# Altium schematic sheet keyboard84.SchDoc
size A3
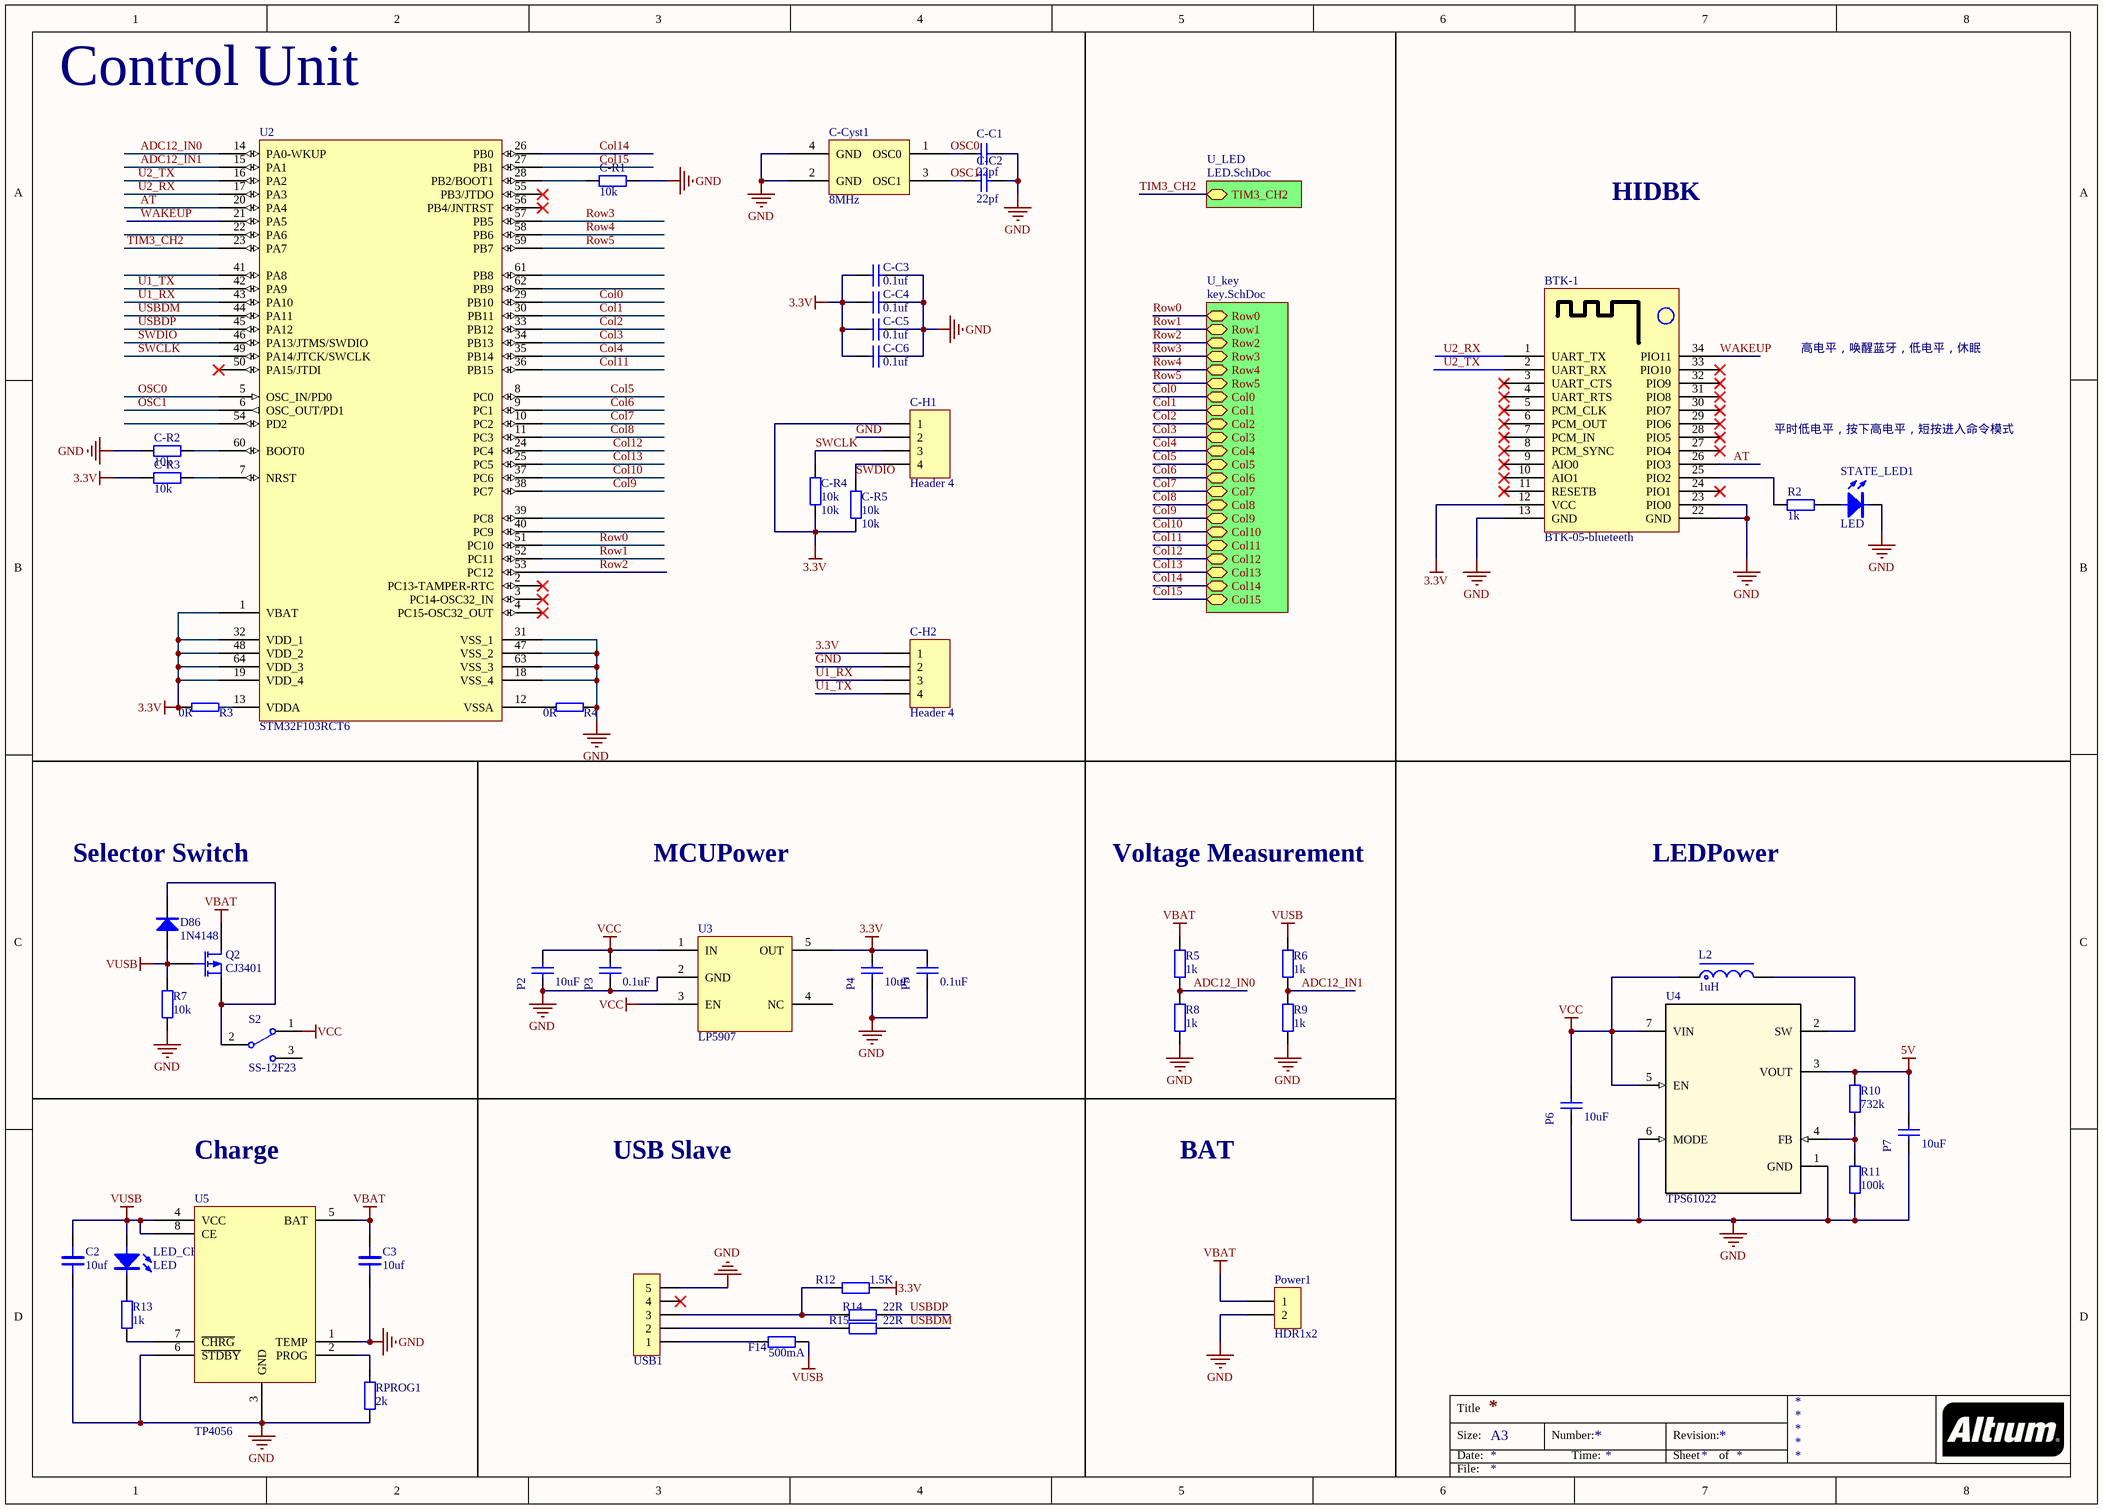
[diagram p0: keyboard84.SchDoc]

## Parts
BTK-1  BTK-05-blueteeth  [BTK-05-bluteeth]
C2  10uf  [C 0603_L]
C3  10uf  [C 0603_L]
C-C1  22pf  [C 0402_L]
C-C2  22pf  [C 0402_L]
C-C3  0.1uf  [C 0402_L]
C-C4  0.1uf  [C 0402_L]
C-C5  0.1uf  [C 0402_L]
C-C6  0.1uf  [C 0402_L]
C-Cyst1  8MHz  [OSC 3225-4P]
C-H1  Header 4  [GH1.25-4P - duplicate]
C-H2  Header 4  [GH1.25-4P - duplicate]
C-R1  10k  [R 0402_L]
C-R2  10k  [R 0402_L]
C-R3  10k  [R 0402_L]
C-R4  10k  [R 0402_L]
C-R5  10k  [R 0402_L]
D86  1N4148  [SOD-323]
F14  500mA  [R 0603_L]
L2  1uH  [CD31]
LED_CHRG1  LED  [LED 0603W]
P2  10uF  [C 0603_L]
P3  0.1uF  [C 0603_L]
P4  10uF  [C 0603_L]
P5  0.1uF  [C 0603_L]
P6  10uF  [C 0603_L]
P7  10uF  [C 0603_L]
Power1  HDR1x2  [HDR2.54-LI-2P]
Q2  CJ3401  [SOT23-3]
R2  1k  [R 0603_L]
R3  0R  [R 0402_L]
R4  0R  [R 0402_L]
R5  1k  [R 0603_L]
R6  1k  [R 0603_L]
R7  10k  [R 0603_L]
R8  1k  [R 0603_L]
R9  1k  [R 0603_L]
R10  732k  [R 0603_L]
R11  100k  [R 0603_L]
R12  1.5K  [R 0402_L]
R13  1k  [R 0603_L]
R14  22R  [R 0402_L]
R15  22R  [R 0402_L]
RPROG1  2k  [R 0603_L]
S2  SS-12F23  [SS-12D10]
STATE_LED1  LED  [LED 0603W]
U2  STM32F103RCT6  [LQFP64_L]
U3  LP5907  [SOT23-5N]
U4  TPS61022  [VQFN-7]
U5  TP4056  [ESOP8_N]
USB1  USB Slave_c  [USB-MICRO - duplicate]  (value not drawn)

## Sub-sheets
U_key = key.SchDoc: Row0 (bidir), Row1 (bidir), Row2 (bidir), Row3 (bidir), Row4 (bidir), Row5 (bidir), Col0 (bidir), Col1 (bidir), Col2 (bidir), Col3 (bidir), Col4 (bidir), Col5 (bidir), Col6 (bidir), Col7 (bidir), Col8 (bidir), Col9 (bidir), Col10 (bidir), Col11 (bidir), Col12 (bidir), Col13 (bidir), Col14 (bidir), Col15 (bidir)
U_LED = LED.SchDoc: TIM3_CH2 (bidir)

## Nets
3.3V: BTK-1.12(VCC) C-C3.2 C-C4.2 C-C5.2 C-C6.2 C-H1.1 C-H2.1 C-R3.1 C-R4.1 C-R5.1 P4.2 P5.2 R3.2 R12.1 U2.1(VBAT) U2.19(VDD_4) U2.32(VDD_1) U2.48(VDD_2) U2.64(VDD_3) U3.5(OUT)
5V: P7.2 R10.2 U4.3(VOUT)
GND: BTK-1.13(GND) BTK-1.22(GND) BTK-1.23(PIO0) C2.1 C3.1 C-C1.1 C-C2.1 C-C3.1 C-C4.1 C-C5.1 C-C6.1 C-Cyst1.2(GND) C-Cyst1.4(GND) C-H1.2 C-H2.2 C-R1.1 C-R2.1 P2.1 P3.1 P4.1 P5.1 P6.1 P7.1 Power1.2 R4.1 R7.1 R8.1 R9.1 R11.1 RPROG1.1 STATE_LED1.2(C) U2.18(VSS_4) U2.31(VSS_1) U2.47(VSS_2) U2.63(VSS_3) U3.2(GND) U4.1(GND) U4.6(MODE) U5.1(TEMP) U5.3(GND) U5.6(~{STDBY}) USB1.5
VBAT: C3.2 Power1.1 Q2.2(D) R5.2 U5.5(BAT)
VCC: L2.1 P2.2 P3.2 P6.2 S2.1 U3.1(IN) U3.3(EN) U4.5(EN) U4.7(VIN)
VUSB: C2.2 D86.1(A) F14.1 LED_CHRG1.1(A) Q2.1(G) R6.2 R7.2 U5.4(VCC) U5.8(CE)
ADC12_IN0: R5.1 R8.2 U2.14(PA0-WKUP)
ADC12_IN1: R6.1 R9.2 U2.15(PA1)
AT: BTK-1.26(PIO3) U2.20(PA4)
Col0: U2.29(PB10) ; sheet U_key/Col0
Col1: U2.30(PB11) ; sheet U_key/Col1
Col2: U2.33(PB12) ; sheet U_key/Col2
Col3: U2.34(PB13) ; sheet U_key/Col3
Col4: U2.35(PB14) ; sheet U_key/Col4
Col5: U2.8(PC0) ; sheet U_key/Col5
Col6: U2.9(PC1) ; sheet U_key/Col6
Col7: U2.10(PC2) ; sheet U_key/Col7
Col8: U2.11(PC3) ; sheet U_key/Col8
Col9: U2.38(PC7) ; sheet U_key/Col9
Col10: U2.37(PC6) ; sheet U_key/Col10
Col11: U2.36(PB15) ; sheet U_key/Col11
Col12: U2.24(PC4) ; sheet U_key/Col12
Col13: U2.25(PC5) ; sheet U_key/Col13
Col14: U2.26(PB0) ; sheet U_key/Col14
Col15: U2.27(PB1) ; sheet U_key/Col15
OSC0: C-C1.2 C-Cyst1.1(OSC0) U2.5(OSC_IN/PD0)
OSC1: C-C2.2 C-Cyst1.3(OSC1) U2.6(OSC_OUT/PD1)
Row0: U2.51(PC10) ; sheet U_key/Row0
Row1: U2.52(PC11) ; sheet U_key/Row1
Row2: U2.53(PC12) ; sheet U_key/Row2
Row3: U2.57(PB5) ; sheet U_key/Row3
Row4: U2.58(PB6) ; sheet U_key/Row4
Row5: U2.59(PB7) ; sheet U_key/Row5
SWCLK: C-H1.3 C-R4.2 U2.49(PA14/JTCK/SWCLK)
SWDIO: C-H1.4 C-R5.2 U2.46(PA13/JTMS/SWDIO)
TIM3_CH2: U2.23(PA7) ; sheet U_LED/TIM3_CH2
U1_RX: C-H2.3 U2.43(PA10)
U1_TX: C-H2.4 U2.42(PA9)
U2_RX: BTK-1.1(UART_TX) U2.17(PA3)
U2_TX: BTK-1.2(UART_RX) U2.16(PA2)
USBDM: R15.1 U2.44(PA11)
USBDP: R14.1 U2.45(PA12)
WAKEUP: BTK-1.34(PIO11) U2.21(PA5)
NetBTK-1_25: BTK-1.25(PIO2) R2.1
NetC-R1_2: C-R1.2 U2.28(PB2/BOOT1)
NetC-R2_2: C-R2.2 U2.60(BOOT0)
NetC-R3_2: C-R3.2 U2.7(NRST)
NetD86_2: D86.2(K) Q2.3(S) S2.2
NetF14_2: F14.2 USB1.1
NetL2_2: L2.2 U4.2(SW)
NetLED_CHRG1_2: LED_CHRG1.2(C) R13.2
NetR2_2: R2.2 STATE_LED1.1(A)
NetR3_1: R3.1 U2.13(VDDA)
NetR4_2: R4.2 U2.12(VSSA)
NetR10_1: R10.1 R11.2 U4.4(FB)
NetR12_2: R12.2 R14.2 USB1.3
NetR13_1: R13.1 U5.7(~{CHRG})
NetR15_2: R15.2 USB1.2
NetRPROG1_2: RPROG1.2 U5.2(PROG)

Not connected (* = marked no-connect by the designer): BTK-1 3(UART_CTS)* 4(UART_RTS)* 5(PCM_CLK)* 6(PCM_OUT)* 7(PCM_IN)* 8(PCM_SYNC)* 9(AIO0)* 10(AIO1)* 11(RESETB)* 24(PIO1)* 27(PIO4)* 28(PIO5)* 29(PIO6)* 30(PIO7)* 31(PIO8)* 32(PIO9)* 33(PIO10)*; S2 3; U2 2(PC13-TAMPER-RTC)* 3(PC14-OSC32_IN)* 4(PC15-OSC32_OUT)* 22(PA6) 39(PC8) 40(PC9) 41(PA8) 50(PA15/JTDI)* 54(PD2) 55(PB3/JTDO)* 56(PB4/JNTRST)* 61(PB8) 62(PB9); U3 4(NC); USB1 4*

## Notes on the sheet
- Control Unit
- HIDBK
- 高电平，唤醒蓝牙，低电平，休眠
- 平时低电平，按下高电平，短按进入命令模式
- (near D86) Selector Switch
- MCUPower
- Voltage Measurement
- LEDPower
- Charge
- USB Slave
- BAT
- Title
- Size:
- Date:
- A3
- Number:
- Time:
- Revision:
- Sheet
- of
- File:

## Library data of the parts
C2 C3 = CAP: Capacitor
C-C1 C-C2 P2-P7 = Cap: LastUpadateTime: 2018-5-12; Package: SOC
  C-C1 C-C2: val: 22pf
  P2 P4 P6 P7: val: 10uF
  P3 P5: val: 0.1uF
C-C3-C-C6 = Cap: Capacitor; Published: 8-Jun-2000; LatestRevisionDate: 17-Jul-2002; LatestRevisionNote: Re-released for DXP Platform.; PackageReference: RAD-0.3; Publisher: Altium Limited; PackageDescription: Radial Cap, Thru-Hole; 2 Leads; 0.3 in Pin Spacing; Value: 0.1uf
C-Cyst1 = Crystal
C-H1 C-H2 = Header 4: Header, 4-Pin; LatestRevisionDate: 17-Jul-2002; LatestRevisionNote: Re-released for DXP Platform.; Publisher: Altium Limited
C-R1-C-R5 F14 R12 R14 R15 = Res2: Resistor
  C-R1-C-R5: Published: 8-Jun-2000; LatestRevisionDate: 17-Jul-2002; LatestRevisionNote: Re-released for DXP Platform.; PackageReference: AXIAL-0.4; Publisher: Altium Limited; PackageDescription: Axial Device, Thru-Hole; 2 Leads; 0.4 in Pin Spacing; Value: 10k
D86 = 1N4148: 开关二极管; BOM名称: 高速开关二极管; 淘宝ID: 封装库来自淘宝 ID：黄晶宝石; 欢迎光临: https://shop463601444.taobao.com
L2 = L-SMD: CD系列贴片线绕功率电感; BOM名称: 功率电感; 淘宝ID: 封装库来自淘宝 ID：黄晶宝石; 学习资源: www.ooocke.com
Power1 = HDR1x2: Connector
Q2 = MOSFET-P: P-Channel MOSFET; Published: 8-Jun-2000; LatestRevisionDate: 17-Jul-2002; LatestRevisionNote: Re-released for DXP Platform.; PackageVersion: 1995/1996; PackageReference: E3; Publisher: Altium Limited
R2 R5-R11 R13 RPROG1 = RES: Resistor
R3 R4 = R
S2 = SSW-1P: 1路波动开关; BOM名称: 波动开关; 版权归属: 封装库来自淘宝 ID：黄晶宝石; 学习资源: https://shop463601444.taobao.com
U2 = STM32F103RxTx: MCU
U3 = LP5907MFX
USB1 = Header 5: 5P接插件; 学习资源: 封装库来自淘宝 ID：黄晶宝石; BOM名称: 5P接插件; 联系售后: https://shop463601444.taobao.com